# Altium project TP3 - Driver Servo.PrjPcb
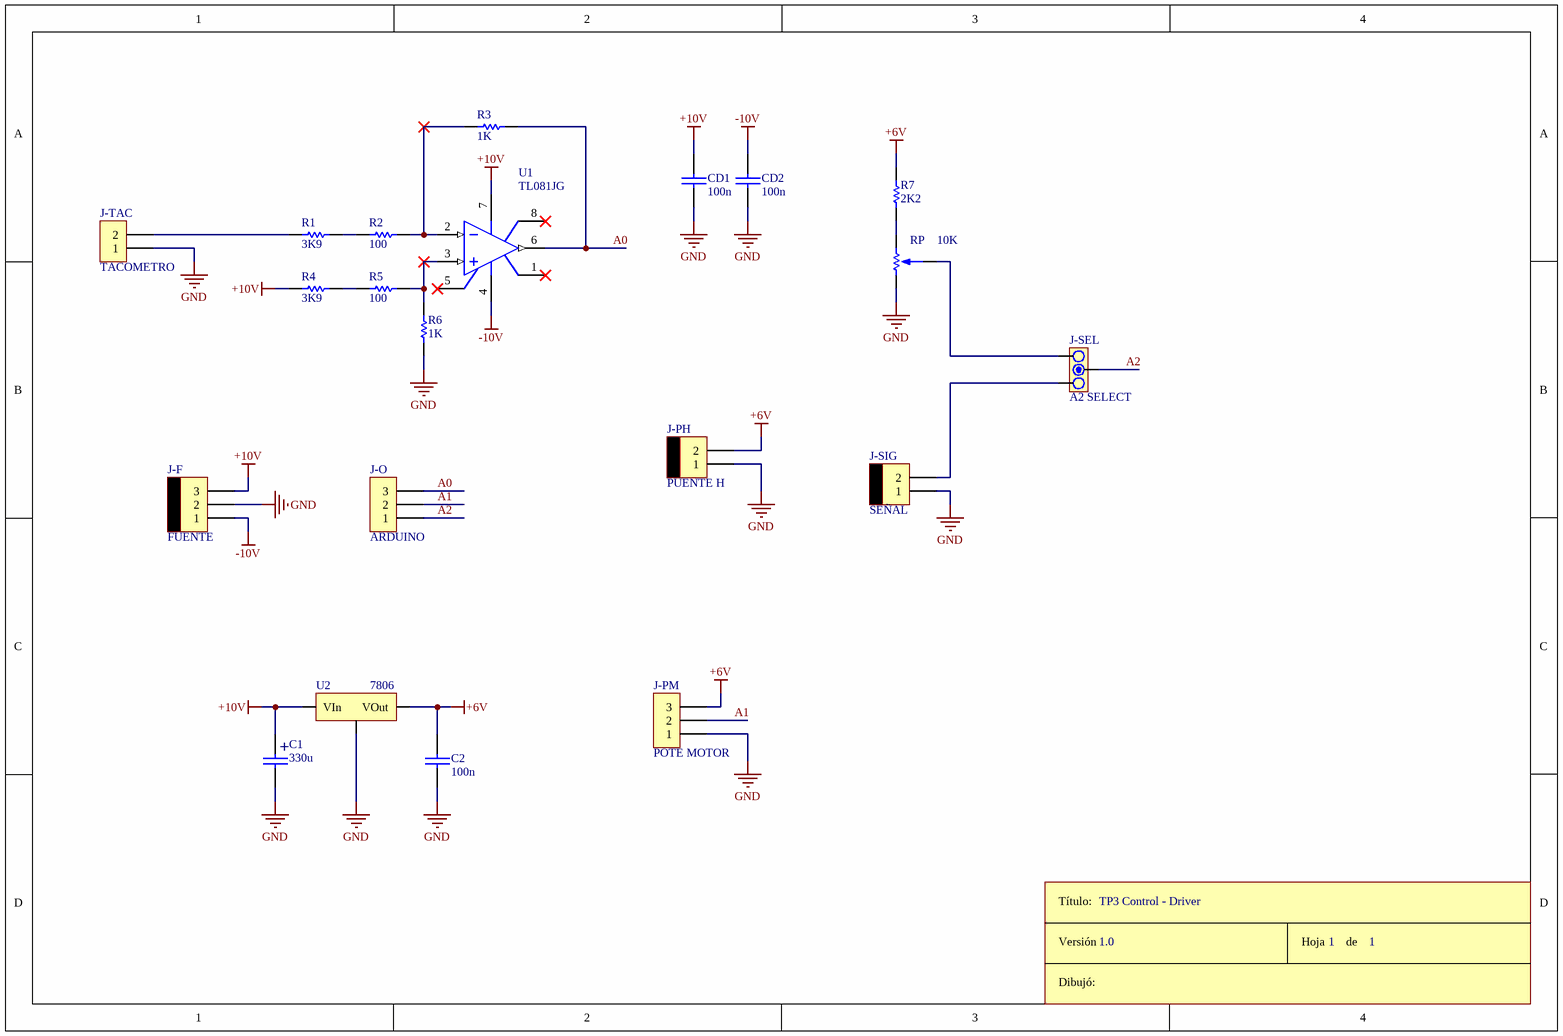
[diagram p0: EsquematicoDriver.SchDoc]
1 sheet, 22 parts. Net scope: global (net labels, ports and power ports of the same name join across sheets).
Board file: PlacaDriver.PcbDoc

## Sheet EsquematicoDriver.SchDoc
size A4

### Parts
C1  330u  [CAP200RP]
C2  100n  [CAP100]
CD1  100n  [CAP100]
CD2  100n  [CAP100]
J-F  FUENTE  [MOLEX3]
J-O  ARDUINO  [SIP3]
J-PH  PUENTE H  [MOLEX2]
J-PM  POTE MOTOR  [BORNERA3]
J-SEL  A2 SELECT  [JUMPER3]
J-SIG  SEÑAL  [MOLEX2]
J-TAC  TACOMETRO  [BORNERA2]
R1  3K9  [RES300]
R2  100  [RES300]
R3  1K  [RES300]
R4  3K9  [RES300]
R5  100  [RES300]
R6  1K  [RES300]
R7  2K2  [RES300]
ROT1  Rótulo  (value not drawn)
RP  10K  [POTENCIOMETRO]
U1  TL081JG  [JG008]
U2  7806  [TO-220 V]

### Nets
+6V: C2.1 J-PH.2 J-PM.3 R7.2 U2.3(VOut)
+10V: C1.1 CD1.1 J-F.3 R4.1 U1.7(V+) U2.1(VIn)
-10V: CD2.1 J-F.1 U1.4(V-)
GND: C1.2 C2.2 CD1.2 CD2.2 J-F.2 J-PH.1 J-PM.1 J-SIG.1 J-TAC.1 R6.1 RP.3 U2.2(GND)
A0: J-O.3 R3.2 U1.6(OUT)
A1: J-O.2 J-PM.2
A2: J-O.1 J-SEL.2
NetJ-SEL_1: J-SEL.1 J-SIG.2
NetJ-SEL_3: J-SEL.3 RP.2
NetJ-TAC_2: J-TAC.2 R1.1
NetR1_2: R1.2 R2.1
NetR2_2: R2.2 R3.1 U1.2(IN-)
NetR4_2: R4.2 R5.1
NetR5_2: R5.2 R6.2 U1.3(IN+)
NetR7_1: R7.1 RP.1

Not connected (* = marked no-connect by the designer): U1 1(OS_TRIM)* 5(OS_TRIM)* 8(NC)*

### Notes on the sheet
- TP3 Control - Driver
- 1.0
- 1
- (in symbol CAPPOL) +
- (in symbol Rótulo) Título:; Versión; Hoja       de; Dibujó:

### Library data of the parts
C1 = CAPPOL
C2 CD1 CD2 = CAP
J-F = MOLEX3
J-O = CON3
J-PH J-SIG = MOLEX2
J-PM = BORNERA 3
J-SEL = JUMPER3
J-TAC = BORNERA 2
R1-R7 = RES
RP = POTENCIOMETRO
U1 = TL081JG: JFET-Input Operational Amplifier; Note: Pin 8 is not connected; Published: 16-Jan-2001; LatestRevisionDate: 04-Mar-2005; LatestRevisionNote: Stylized 3D Model Added.; DatasheetVersion: Feb-1999; PackageVersion: Jan-1995; PackageReference: JG008; Publisher: Altium Limited; PackageDescription: DIP; 8 Leads; Row Spacing 7.62 mm; Pitch 2.54 mm; ComponentLink1Description: Manufacturer Link; ComponentLink1URL: http://www.ti.com/; ComponentLink2Description: Datasheet; ComponentLink2URL: http://www-s.ti.com/sc/ds/tl081.pdf
U2 = 78XX: REGULDOR POSITIVO